# Altium schematic sheet Debug & Test Points.SchDoc: Debug & Test Points
size B; Organization: Drexel University; Address1: ECE Senior Design; Address2: 2018-2019; Address3: ECE-08; Revision: 1.0; SheetNumber: 3; SheetTotal: 9; PageSetup: Record=PageOptions|CenterHorizontal=True|CenterVertical=True|PrintScale=1.00|XCorrection=1.00|YCorrection=1.00|PrintKind=0|BorderSize=5000000|LeftOffset=0|BottomOffset=0|Orientation=2|PaperLength=1000|PaperWidth=1000|Scale=100|PaperSource=7|PrintQuality=-3|MediaType=1|DitherType=10|PrintScaleMode=1|PaperKind=Letter|PaperIndex=1
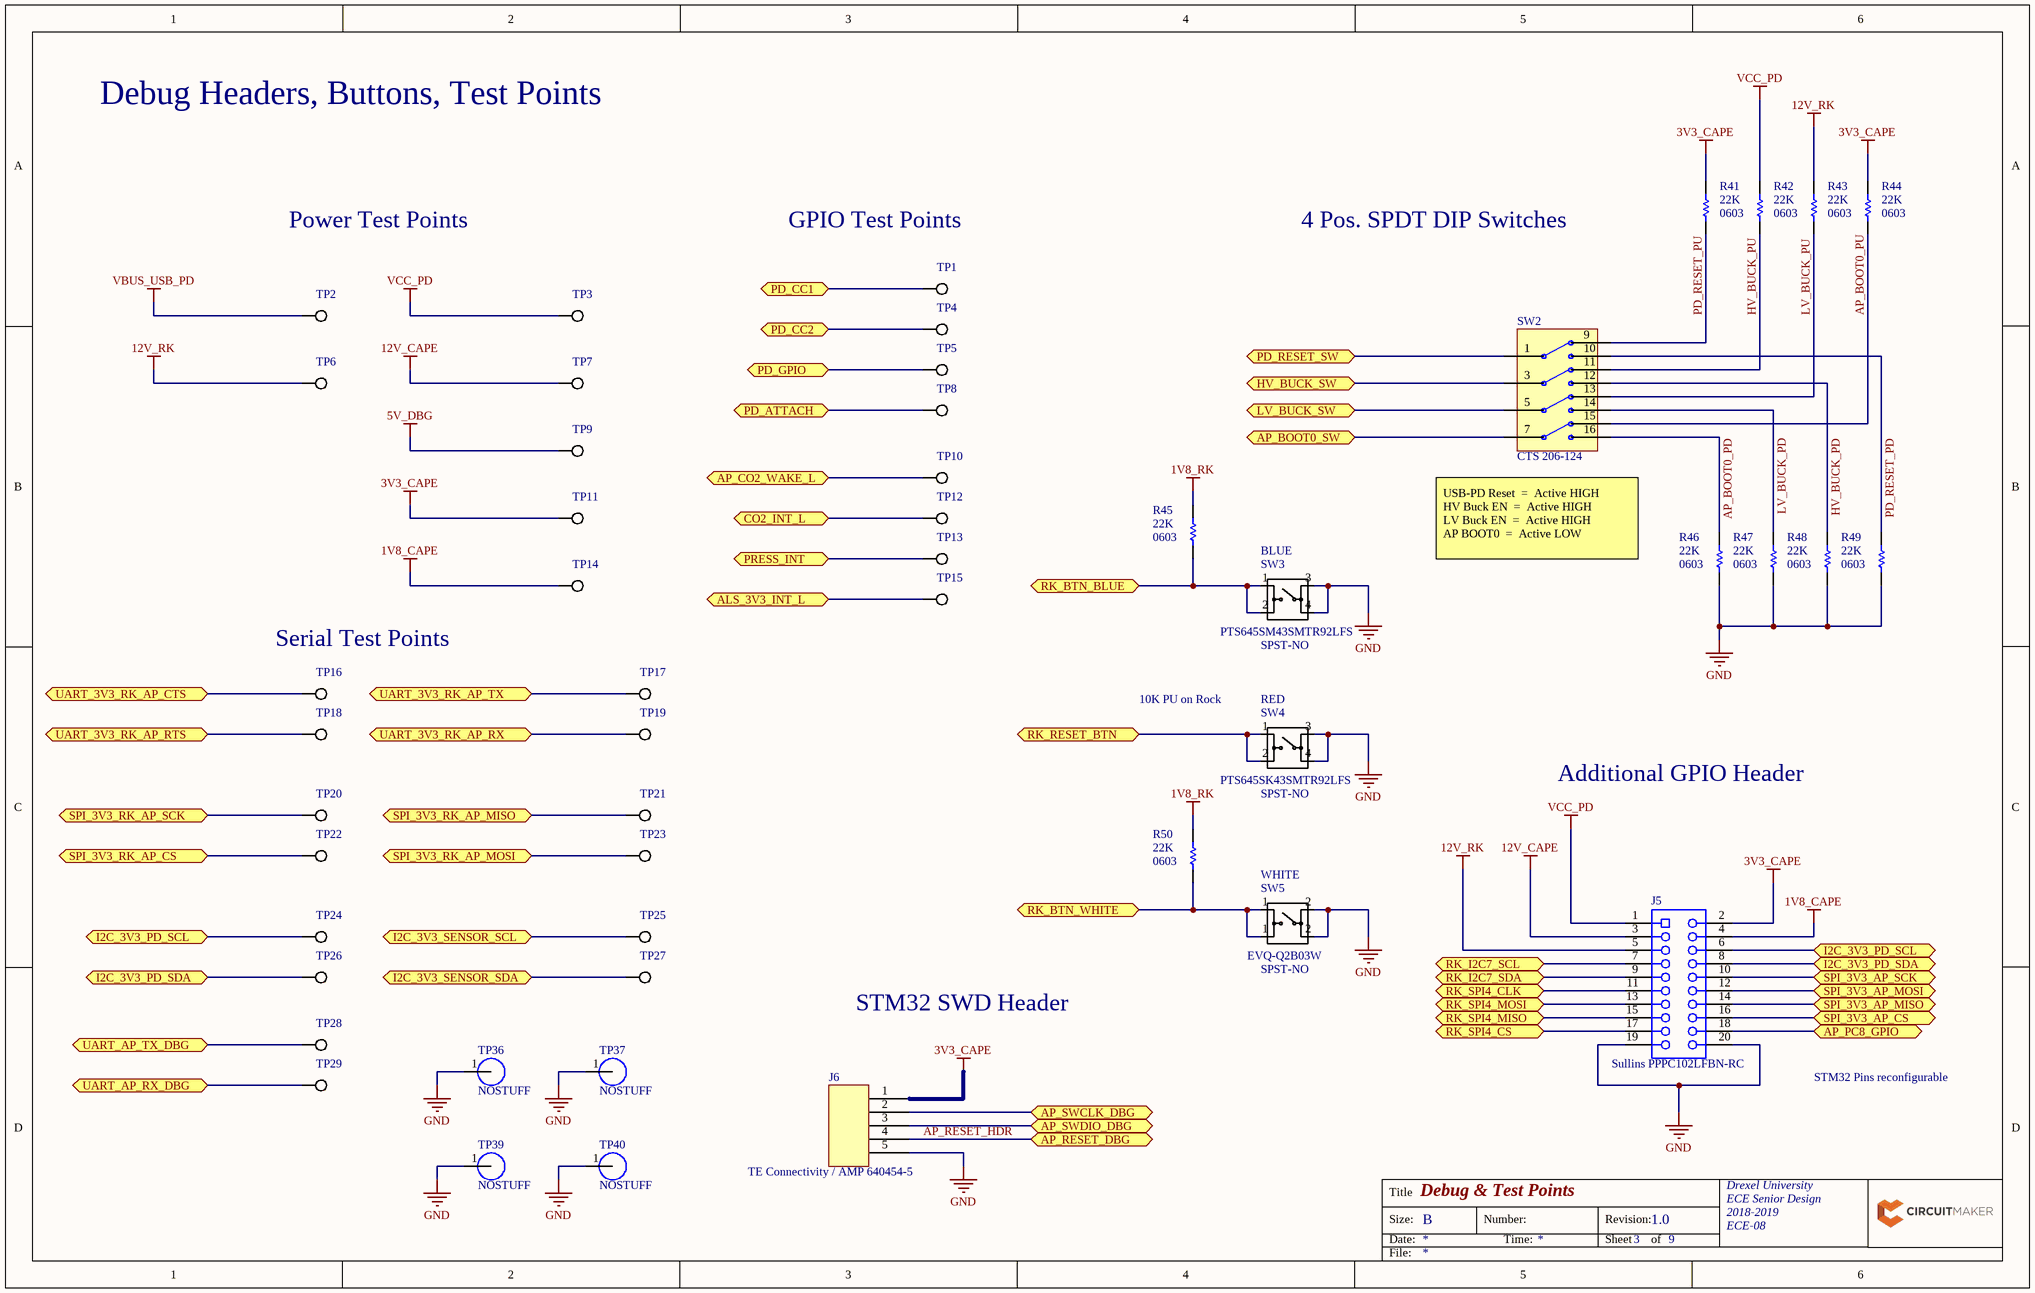
[diagram p0: Debug & Test Points.SchDoc]

## Parts
J5  Sullins PPPC102LFBN-RC  [SLIN-PPPC102LFBN-RC_V]
J6  TE Connectivity / AMP 640454-5  [PCB-cjz7utnpmh9dagnjcosy-1]
R41  Resistance: 22K  Case/Package: 0603  [RESC1608X55X25LL10T15]  (hidden comment: Yageo RC0603FR-0722KL)
R42  Resistance: 22K  Case/Package: 0603  [RESC1608X55X25LL10T15]  (hidden comment: Yageo RC0603FR-0722KL)
R43  Resistance: 22K  Case/Package: 0603  [RESC1608X55X25LL10T15]  (hidden comment: Yageo RC0603FR-0722KL)
R44  Resistance: 22K  Case/Package: 0603  [RESC1608X55X25LL10T15]  (hidden comment: Yageo RC0603FR-0722KL)
R45  Resistance: 22K  Case/Package: 0603  [RESC1608X55X25LL10T15]  (hidden comment: Yageo RC0603FR-0722KL)
R46  Resistance: 22K  Case/Package: 0603  [RESC1608X55X25LL10T15]  (hidden comment: Yageo RC0603FR-0722KL)
R47  Resistance: 22K  Case/Package: 0603  [RESC1608X55X25LL10T15]  (hidden comment: Yageo RC0603FR-0722KL)
R48  Resistance: 22K  Case/Package: 0603  [RESC1608X55X25LL10T15]  (hidden comment: Yageo RC0603FR-0722KL)
R49  Resistance: 22K  Case/Package: 0603  [RESC1608X55X25LL10T15]  (hidden comment: Yageo RC0603FR-0722KL)
R50  Resistance: 22K  Case/Package: 0603  [RESC1608X55X25LL10T15]  (hidden comment: Yageo RC0603FR-0722KL)
SW2  CTS 206-124  [PCB-nbvsi55tyuro9im52r90-1]
SW3  Manufacturer Part Number: PTS645SM43SMTR92LFS  Contacts Type: SPST-NO  [PCB-s4cw3ztviwh2470uqn6q-1]  (hidden comment: C&K Components PTS645SM43SMTR92LFS)
SW4  Manufacturer Part Number: PTS645SK43SMTR92LFS  Contacts Type: SPST-NO  [PCB-2l25iuk5dcek232nr8ss-1]  (hidden comment: C&K Components PTS645SK43SMTR92LFS)
SW5  Manufacturer Part Number: EVQ-Q2B03W  Contacts Type: SPST-NO  [PCB-772q97a3nev1hwheshwj-1]  (hidden comment: Panasonic EVQ-Q2B03W)
TP1  SYM-r3tntvff39g057zxjnnx-1  [PCB-hew5anfrhkqvtgt23eko-1]  (value not drawn)
TP2  SYM-r3tntvff39g057zxjnnx-1  [PCB-hew5anfrhkqvtgt23eko-1]  (value not drawn)
TP3  SYM-r3tntvff39g057zxjnnx-1  [PCB-hew5anfrhkqvtgt23eko-1]  (value not drawn)
TP4  SYM-r3tntvff39g057zxjnnx-1  [PCB-hew5anfrhkqvtgt23eko-1]  (value not drawn)
TP5  SYM-r3tntvff39g057zxjnnx-1  [PCB-hew5anfrhkqvtgt23eko-1]  (value not drawn)
TP6  SYM-r3tntvff39g057zxjnnx-1  [PCB-hew5anfrhkqvtgt23eko-1]  (value not drawn)
TP7  SYM-r3tntvff39g057zxjnnx-1  [PCB-hew5anfrhkqvtgt23eko-1]  (value not drawn)
TP8  SYM-r3tntvff39g057zxjnnx-1  [PCB-hew5anfrhkqvtgt23eko-1]  (value not drawn)
TP9  SYM-r3tntvff39g057zxjnnx-1  [PCB-hew5anfrhkqvtgt23eko-1]  (value not drawn)
TP10  SYM-r3tntvff39g057zxjnnx-1  [PCB-hew5anfrhkqvtgt23eko-1]  (value not drawn)
TP11  SYM-r3tntvff39g057zxjnnx-1  [PCB-hew5anfrhkqvtgt23eko-1]  (value not drawn)
TP12  SYM-r3tntvff39g057zxjnnx-1  [PCB-hew5anfrhkqvtgt23eko-1]  (value not drawn)
TP13  SYM-r3tntvff39g057zxjnnx-1  [PCB-hew5anfrhkqvtgt23eko-1]  (value not drawn)
TP14  SYM-r3tntvff39g057zxjnnx-1  [PCB-hew5anfrhkqvtgt23eko-1]  (value not drawn)
TP15  SYM-r3tntvff39g057zxjnnx-1  [PCB-hew5anfrhkqvtgt23eko-1]  (value not drawn)
TP16  SYM-r3tntvff39g057zxjnnx-1  [PCB-hew5anfrhkqvtgt23eko-1]  (value not drawn)
TP17  SYM-r3tntvff39g057zxjnnx-1  [PCB-hew5anfrhkqvtgt23eko-1]  (value not drawn)
TP18  SYM-r3tntvff39g057zxjnnx-1  [PCB-hew5anfrhkqvtgt23eko-1]  (value not drawn)
TP19  SYM-r3tntvff39g057zxjnnx-1  [PCB-hew5anfrhkqvtgt23eko-1]  (value not drawn)
TP20  SYM-r3tntvff39g057zxjnnx-1  [PCB-hew5anfrhkqvtgt23eko-1]  (value not drawn)
TP21  SYM-r3tntvff39g057zxjnnx-1  [PCB-hew5anfrhkqvtgt23eko-1]  (value not drawn)
TP22  SYM-r3tntvff39g057zxjnnx-1  [PCB-hew5anfrhkqvtgt23eko-1]  (value not drawn)
TP23  SYM-r3tntvff39g057zxjnnx-1  [PCB-hew5anfrhkqvtgt23eko-1]  (value not drawn)
TP24  SYM-r3tntvff39g057zxjnnx-1  [PCB-hew5anfrhkqvtgt23eko-1]  (value not drawn)
TP25  SYM-r3tntvff39g057zxjnnx-1  [PCB-hew5anfrhkqvtgt23eko-1]  (value not drawn)
TP26  SYM-r3tntvff39g057zxjnnx-1  [PCB-hew5anfrhkqvtgt23eko-1]  (value not drawn)
TP27  SYM-r3tntvff39g057zxjnnx-1  [PCB-hew5anfrhkqvtgt23eko-1]  (value not drawn)
TP28  SYM-r3tntvff39g057zxjnnx-1  [PCB-hew5anfrhkqvtgt23eko-1]  (value not drawn)
TP29  SYM-r3tntvff39g057zxjnnx-1  [PCB-hew5anfrhkqvtgt23eko-1]  (value not drawn)
TP36  Keystone 5015  [PCB-57fxnr3lnfj79tb7d57h-1]  (value not drawn)  (no BOM)
TP37  Keystone 5015  [PCB-57fxnr3lnfj79tb7d57h-1]  (value not drawn)  (no BOM)
TP39  Keystone 5015  [PCB-57fxnr3lnfj79tb7d57h-1]  (value not drawn)  (no BOM)
TP40  Keystone 5015  [PCB-57fxnr3lnfj79tb7d57h-1]  (value not drawn)  (no BOM)

## Ports
ALS_3V3_INT_L, AP_BOOT0_SW, AP_CO2_WAKE_L, AP_PC8_GPIO, AP_RESET_DBG, AP_SWCLK_DBG, AP_SWDIO_DBG, CO2_INT_L, HV_BUCK_SW, I2C_3V3_PD_SCL, I2C_3V3_PD_SCL (bidir), I2C_3V3_PD_SDA, I2C_3V3_PD_SDA (bidir), I2C_3V3_SENSOR_SCL, I2C_3V3_SENSOR_SDA, LV_BUCK_SW, PD_ATTACH, PD_CC1 (bidir), PD_CC2 (bidir), PD_GPIO, PD_RESET_SW (bidir), PRESS_INT, RK_BTN_BLUE, RK_BTN_WHITE, RK_I2C7_SCL (bidir), RK_I2C7_SDA (bidir), RK_RESET_BTN, RK_SPI4_CLK (bidir), RK_SPI4_CS (bidir), RK_SPI4_MISO (bidir), RK_SPI4_MOSI (bidir), SPI_3V3_AP_CS, SPI_3V3_AP_MISO, SPI_3V3_AP_MOSI, SPI_3V3_AP_SCK, SPI_3V3_RK_AP_CS, SPI_3V3_RK_AP_MISO, SPI_3V3_RK_AP_MOSI, SPI_3V3_RK_AP_SCK, UART_3V3_RK_AP_CTS, UART_3V3_RK_AP_RTS, UART_3V3_RK_AP_RX, UART_3V3_RK_AP_TX, UART_AP_RX_DBG, UART_AP_TX_DBG

## Nets
1V8_CAPE: J5.4 TP14.1
1V8_RK: R45.2 R50.2
3V3_CAPE: J5.2 J6.1 R41.2 R44.2 TP11.1
5V_DBG: TP9.1
12V_CAPE: J5.3 TP7.1
12V_RK: J5.5 R43.2 TP6.1
GND: J5.19 J5.20 J6.5 R46.1 R47.1 R48.1 R49.1 SW3.3 SW3.4 SW4.3 SW4.4 SW5.2 TP36.1 TP37.1 TP39.1 TP40.1
VBUS_USB_PD: TP2.1
VCC_PD: J5.1 R42.2 TP3.1
ALS_3V3_INT_L: TP15.1 ; port ALS_3V3_INT_L
AP_BOOT0_PD: R46.2 SW2.16
AP_BOOT0_PU: R44.1 SW2.15
AP_BOOT0_SW: SW2.7 ; port AP_BOOT0_SW
AP_CO2_WAKE_L: TP10.1 ; port AP_CO2_WAKE_L
AP_PC8_GPIO: J5.18 ; port AP_PC8_GPIO
AP_RESET_HDR: J6.4 ; port AP_RESET_DBG
AP_SWCLK_DBG: J6.2 ; port AP_SWCLK_DBG
AP_SWDIO_DBG: J6.3 ; port AP_SWDIO_DBG
CO2_INT_L: TP12.1 ; port CO2_INT_L
HV_BUCK_PD: R48.2 SW2.12
HV_BUCK_PU: R42.1 SW2.11
HV_BUCK_SW: SW2.3 ; port HV_BUCK_SW
I2C_3V3_PD_SCL: J5.6 TP24.1 ; port I2C_3V3_PD_SCL
I2C_3V3_PD_SDA: J5.8 TP26.1 ; port I2C_3V3_PD_SDA
I2C_3V3_SENSOR_SCL: TP25.1 ; port I2C_3V3_SENSOR_SCL
I2C_3V3_SENSOR_SDA: TP27.1 ; port I2C_3V3_SENSOR_SDA
LV_BUCK_PD: R47.2 SW2.14
LV_BUCK_PU: R43.1 SW2.13
LV_BUCK_SW: SW2.5 ; port LV_BUCK_SW
PD_ATTACH: TP8.1 ; port PD_ATTACH
PD_CC1: TP1.1 ; port PD_CC1
PD_CC2: TP4.1 ; port PD_CC2
PD_GPIO: TP5.1 ; port PD_GPIO
PD_RESET_PD: R49.2 SW2.10
PD_RESET_PU: R41.1 SW2.9
PD_RESET_SW: SW2.1 ; port PD_RESET_SW
PRESS_INT: TP13.1 ; port PRESS_INT
RK_BTN_BLUE: R45.1 SW3.1 SW3.2 ; port RK_BTN_BLUE
RK_BTN_WHITE: R50.1 SW5.1 ; port RK_BTN_WHITE
RK_I2C7_SCL: J5.7 ; port RK_I2C7_SCL
RK_I2C7_SDA: J5.9 ; port RK_I2C7_SDA
RK_RESET_BTN: SW4.1 SW4.2 ; port RK_RESET_BTN
RK_SPI4_CLK: J5.11 ; port RK_SPI4_CLK
RK_SPI4_CS: J5.17 ; port RK_SPI4_CS
RK_SPI4_MISO: J5.15 ; port RK_SPI4_MISO
RK_SPI4_MOSI: J5.13 ; port RK_SPI4_MOSI
SPI_3V3_AP_CS: J5.16 ; port SPI_3V3_AP_CS
SPI_3V3_AP_MISO: J5.14 ; port SPI_3V3_AP_MISO
SPI_3V3_AP_MOSI: J5.12 ; port SPI_3V3_AP_MOSI
SPI_3V3_AP_SCK: J5.10 ; port SPI_3V3_AP_SCK
SPI_3V3_RK_AP_CS: TP22.1 ; port SPI_3V3_RK_AP_CS
SPI_3V3_RK_AP_MISO: TP21.1 ; port SPI_3V3_RK_AP_MISO
SPI_3V3_RK_AP_MOSI: TP23.1 ; port SPI_3V3_RK_AP_MOSI
SPI_3V3_RK_AP_SCK: TP20.1 ; port SPI_3V3_RK_AP_SCK
UART_3V3_RK_AP_CTS: TP16.1 ; port UART_3V3_RK_AP_CTS
UART_3V3_RK_AP_RTS: TP18.1 ; port UART_3V3_RK_AP_RTS
UART_3V3_RK_AP_RX: TP19.1 ; port UART_3V3_RK_AP_RX
UART_3V3_RK_AP_TX: TP17.1 ; port UART_3V3_RK_AP_TX
UART_AP_RX_DBG: TP29.1 ; port UART_AP_RX_DBG
UART_AP_TX_DBG: TP28.1 ; port UART_AP_TX_DBG

## Notes on the sheet
- Debug Headers, Buttons, Test Points
- Power Test Points
- GPIO Test Points
- 4 Pos. SPDT DIP Switches
- (near SW3) BLUE
- (near SW2) USB-PD Reset  =  Active HIGH
  HV Buck EN  =  Active HIGH
  LV Buck EN  =  Active HIGH
  AP BOOT0  =  Active LOW
- (near TP16) Serial Test Points
- 10K PU on Rock
- (near SW4) RED
- Additional GPIO Header
- (near SW5) WHITE
- STM32 SWD Header
- STM32 Pins reconfigurable
- Title
- Size:
- Date:
- B
- Number:
- Time:
- Revision:
- Sheet
- of
- File:
- (in symbol CMP-0dc8c4c22640d20f-15) NOSTUFF

## Library data of the parts
J5 = CMP-dcfd15f3db31033a-2: Female Header, Pitch 2.54 mm, 2 x 10 Position, Height 8.75 mm, Tail Length 3.2 mm, -40 to 105 degC, RoHS, Bulk; Pin Pitch: 2.54 mm; Number of Positions: 20; Lead-Free Status: Lead Free; Housing Material: Plastic; ComponentLink1Description: Datasheet; RoHS: Compliant; Number of Rows: 2; Contact Plating: Gold; Octopart Url: http://octopart.com/pppc102lfbn-rc-sullins-271018; Contact Material: Phosphor Bronze; DatasheetVersion: Rev. D, 10/2007; Size-Height: 8.50 mm; Size-Width: 5.00 mm; Seller Landing  Url: https://octopart.com/click/track?country=US&ak=8157f166&sig=09905bc&sid=459&ppid=271018&vpid=1792693&ct=offers; ComponentLink1URL: http://datasheet.octopart.com/PPPC102LFBN-RC-Sullins-datasheet-8327184.pdf; Mounting Style: Through Hole; PackageDescription: Female Header, Pitch 2.54 mm, 2 x 10 Position, Height 8.75 mm, Tail Length 3.2 mm; PackageReference: PPPC102LFBN-RC; OctopartID: dcfd15f3db31033a; Manufacturer Part Number: PPPC102LFBN-RC; Size-Length: 25.9 mm
J6 = CMP-334df81e3a21ec8a-6: MTA-100 5 Position 2.54 mm Single Row Through-Hole Straight Wire to Board Header; Pin Pitch: 2.54 mm; Mounting Angle: 180 °; ELV Compliant: Compliant; Current Rating: 4.00 A; Gender: Male; Number of Contacts: 5; Lead-Free Status: Lead Free; Shrouded: No; Voltage Rating (AC): 250 V; Contact Plating: Tin; OctopartID: 334df81e3a21ec8a; Packaging: Bag; Orientation: Vertical; Mounting Style: Through Hole, Vertical; Contact Material: Copper Alloy; Size-Height: 7.87 mm; Octopart URL: http://octopart.com/640454-5-te+connectivity+%2F+amp-39398410; Housing Color: Natural; Size-Length: 12.7 mm; Number of Positions: 5; Flammability Rating: UL 94 V-0; Manufacturer Part Number: 640454-5; Lifecycle Status: Active; Number of Rows: 1; Size-Width: 5.71 mm; RoHS: Compliant; Housing Material: Polyester; REACH SVHC Compliance: No SVHC
R41-R50 = CMP-1853446-5: Chip Resistor, 22 KOhm, +/- 1%, 0.1 W, -55 to 155 degC, 0603 (1608 Metric), RoHS, Tape and Reel; Power Rating: 1/10W; Voltage Rating (DC): 50.0 V; Lead-Free Status: Lead Free; Case/Package (SI): 1608; Number of Pins: 2; Size-Height: 450 µm; Resistance Tolerance: 1%; PackageDescription: 2-Pin Surface Mount Device, Body 1.6 x 0.8 mm; Size-Width: 800 µm; Seller Landing  Url: https://octopart-clicks.com/click/track?country=US&ak=8157f166&sig=0952a08&sid=5489&ppid=40952860&vpid=270386233&ct=offers; DatasheetVersion: Rev. 4, 02/2016; PackageReference: 0603; Size-Length: 1.60 mm; RoHS: Compliant; Mounting Style: Surface Mount; OctopartID: 2162ea18e018fea5; Manufacturer Part Number: RC0603FR-0722KL; Packaging: Cut Tape (CT), Tape & Reel (TR); Octopart Url: http://octopart.com/rc0603fr-0722kl-yageo-40952860; REACH SVHC Compliance: No SVHC
SW2 = CMP-9d2d5432b3d942ea-1: Switch DIP OFF ON SPDT 4 Raised Slide 0.05A 24VDC PC Pins 10000Cycles 2.54mm Thru-Hole Tube; Actuator Type: Standard; Carry Current: 100 mA (max); Lead-Free Status: Contains Lead; Number of Positions: 4; Octopart URL: https://octopart.com/206-124-cts+components-1379218; Manufacturer Part Number: 206-124; Contacts Type: SPDT; Mounting Style: Through Hole; Operating Temperature: 85.0 °C (max); Orientation: Vertical; Pin Pitch: 2.54 mm; RoHS: Compliant; Size-Height: 7.62 mm; Size-Width: 22.5 mm; OctopartID: 9d2d5432b3d942ea
SW3 = CMP-3c47f600356ce380-14: Switch Tactile N.O. SPST Round Button Gull Wing 0.05A 12VDC 100000Cycles 1.57N SMD T/R; Lead-Free Status: Lead Free; OctopartID: 3c47f600356ce380; REACH SVHC Compliance: No SVHC; Packaging: Tape & Reel (TR); Octopart URL: http://octopart.com/pts645sm43smtr92lfs-c%26k+components-55389261; Size-Height: 4.30 mm; RoHS: Compliant; Mounting Style: Surface Mount
SW4 = CMP-8f9845df1015505f-1: Switch Tactile N.O SPST Round Button Gull Wing 0.05A 12VDC 100000Cycle 2.55N SMD T/R; Lead-Free Status: Lead Free; Octopart URL: https://octopart.com/pts645sk43smtr92lfs-c%26k+components-55425771; Mounting Style: Surface Mount; Packaging: Tape & Reel (TR); REACH SVHC Compliance: No SVHC; RoHS: Compliant; Size-Height: 4.30 mm; OctopartID: 8f9845df1015505f
SW5 = CMP-0c8bc5972372d34c-1: Switch Tactile ON OFF SPST Round Button J-Bend 0.02A 15VDC 0.5N SMD Embossed T/R; Actuator Type: Standard; Contact Current Rating: 20.0 mA; Contact Resistance: 100 m? (max); Lead-Free Status: Lead Free; Operating Force: 500 m; Octopart URL: https://octopart.com/evq-q2b03w-panasonic-1444511; Color: White; Lifecycle Status: Not Listed by Manufacturer; Mounting Style: Surface Mount; Operating Temperature: -40.0 °C (min); Orientation: Vertical; REACH SVHC Compliance: No SVHC; RoHS: Compliant; Size-Height: 3.10 mm; Size-Length: 6.50 mm; Size-Thickness: 1.80 mm; Size-Width: 6.00 mm; OctopartID: 0c8bc5972372d34c
TP1-TP29 = CMP-r3tntvff39g057zxjnnx-3: SMT Pad Test Point 1.27mm Diameter
TP36 TP37 TP39 TP40 = CMP-0dc8c4c22640d20f-15: Test Point; Micro Mini; SMT; Phos Bronze/Silver; 1000pc Tape & Reel; Material: Phosphor Bronze